# EAGLE design bluepill (EAGLE 7.4.0)
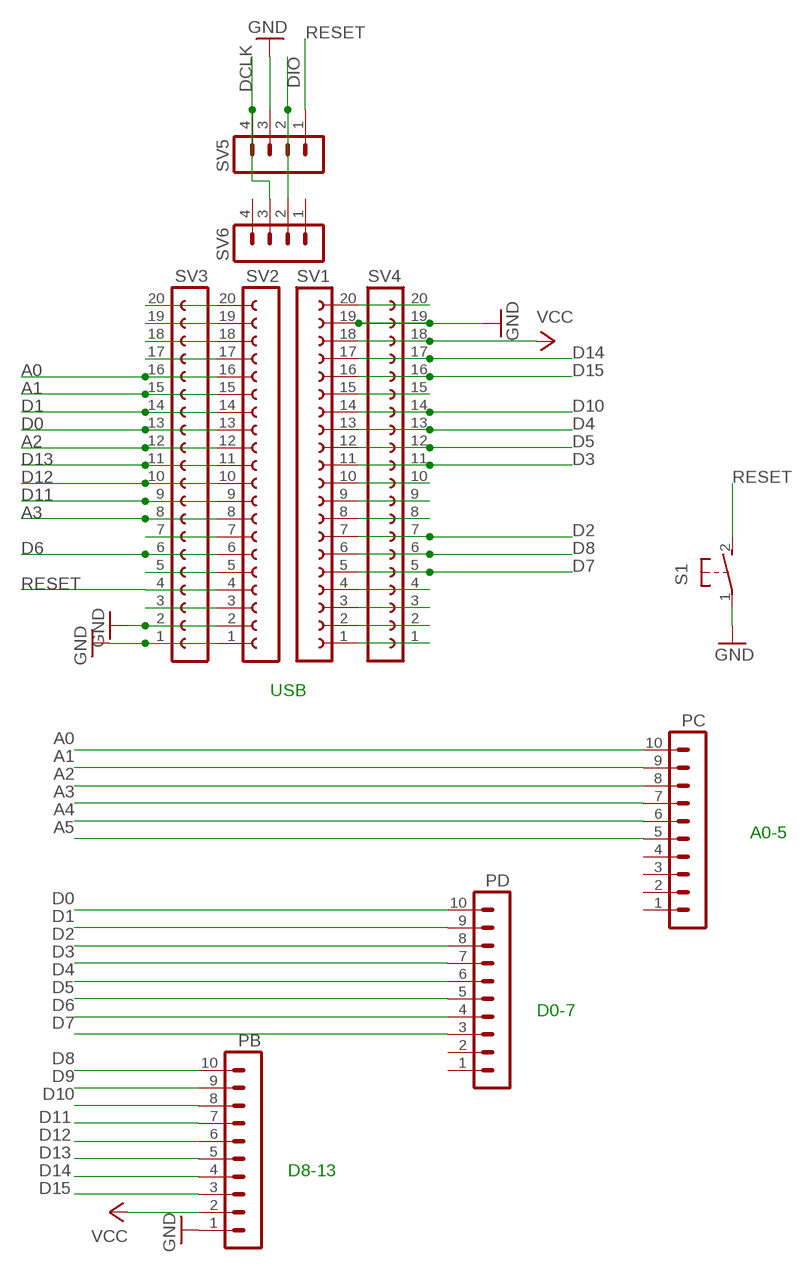
[diagram p0: schematic, sheet 1]

## Parts
PB  MA10-1W  [MA10-1W]
PC  MA10-1W  [MA10-1W]
PD  MA10-1W  [MA10-1W]
S1  31-XX  [B3F-31XX]
SV1  FE20-1  [FE20]
SV2  FE20-1  [FE20]
SV3  FE20-1  [FE20]
SV4  FE20-1  [FE20]
SV5  MA04-1  [MA04-1]
SV6  MA04-1  [MA04-1]

## Nets
A0: PC.10 SV2.16 SV3.16
A1: PC.9 SV2.15 SV3.15
A2: PC.8 SV2.12 SV3.12
A3: PC.7 SV2.8 SV3.8
A4: PC.6
A5: PC.5
D0: PD.10 SV2.13 SV3.13
D1: PD.9 SV2.14 SV3.14
D2: PD.8 SV1.7 SV4.7
D3: PD.7 SV1.11 SV4.11
D4: PD.6 SV1.13 SV4.13
D5: PD.5 SV1.12 SV4.12
D6: PD.4 SV2.6 SV3.6
D7: PD.3 SV1.5 SV4.5
D8: PB.10 SV1.6 SV4.6
D9: PB.9
D10: PB.8 SV1.14 SV4.14
D11: PB.7 SV2.9 SV3.9
D12: PB.6 SV2.10 SV3.10
D13: PB.5 SV2.11 SV3.11
D14: PB.4 SV1.17 SV4.17
D15: PB.3 SV1.16 SV4.16
DCLK: SV5.4 SV6.3
DIO: SV5.2 SV6.2
GND: PB.1 S1.1(P) SV1.19 SV2.1 SV2.2 SV3.1 SV3.2 SV4.19 SV5.3
N$1: SV2.3 SV3.3
N$3: SV2.5 SV3.5
N$4: SV2.7 SV3.7
N$5: SV2.17 SV3.17
N$6: SV2.18 SV3.18
N$7: SV2.19 SV3.19
N$8: SV2.20 SV3.20
N$10: SV1.1 SV4.1
N$11: SV1.2 SV4.2
N$12: SV1.3 SV4.3
N$13: SV1.4 SV4.4
N$14: SV1.8 SV4.8
N$15: SV1.9 SV4.9
N$16: SV1.10 SV4.10
N$17: SV1.15 SV4.15
N$18: SV1.20 SV4.20
RESET: S1.2(S) SV2.4 SV3.4 SV5.1
VCC: PB.2 SV1.18 SV4.18
Unconnected: PC.1 PC.2 PC.3 PC.4 PD.1 PD.2 SV6.1 SV6.4

## Notes on the sheet
- USB
- A0-5
- D0-7
- D8-13

## Library data of the parts
PB PC PD = con-lstb:MA10-1W: PIN HEADER
S1 = switch-omron:31-XX: OMRON SWITCH; MPN: B3F-3100; OC_FARNELL: 959704; OC_NEWARK: 36M3582
SV1-SV4 = con-lsta:FE20-1: FEMALE HEADER; OC_FARNELL: unknown; OC_NEWARK: unknown
SV5 SV6 = con-lstb:MA04-1: PIN HEADER; OC_FARNELL: unknown; OC_NEWARK: unknown

## Board
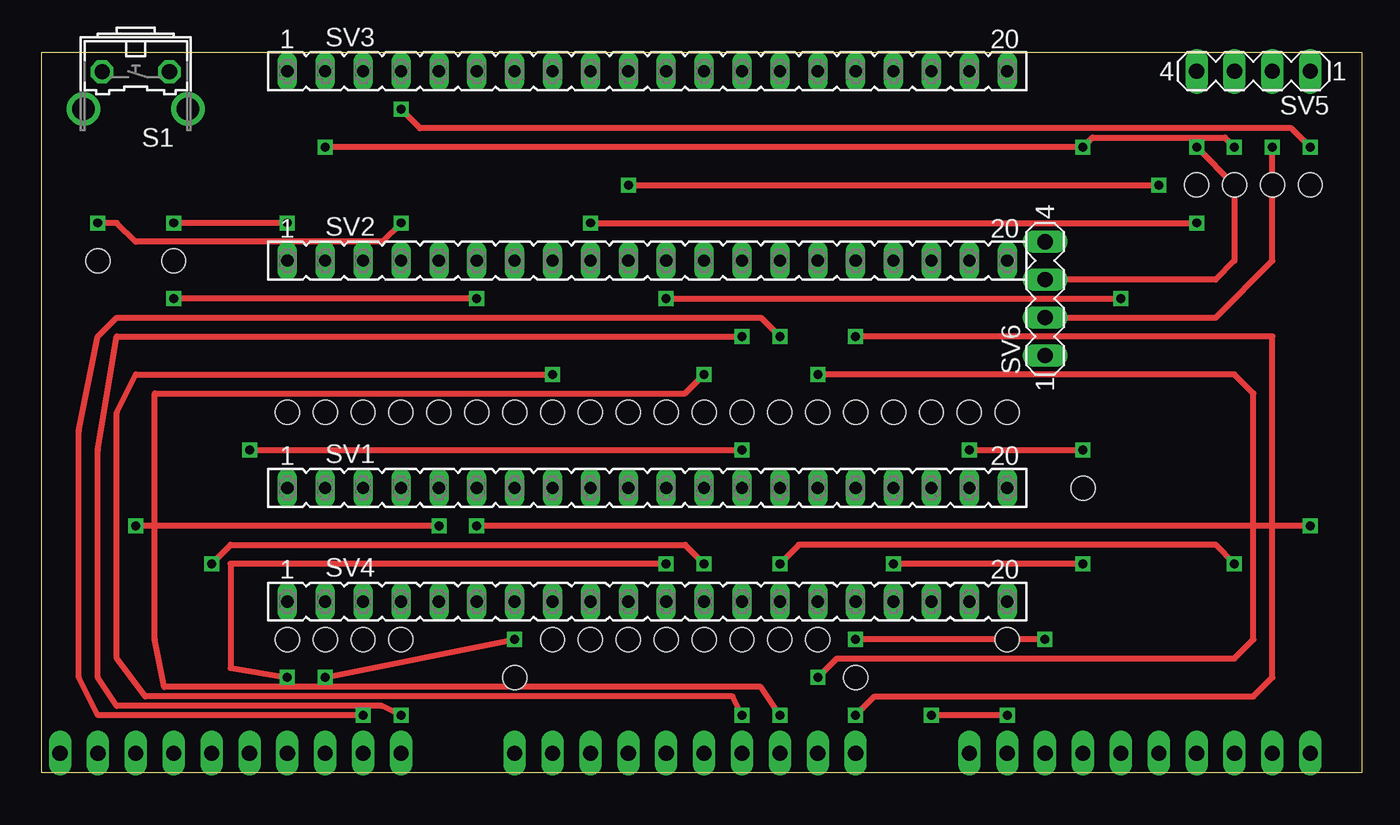
[diagram p1: board, top side]
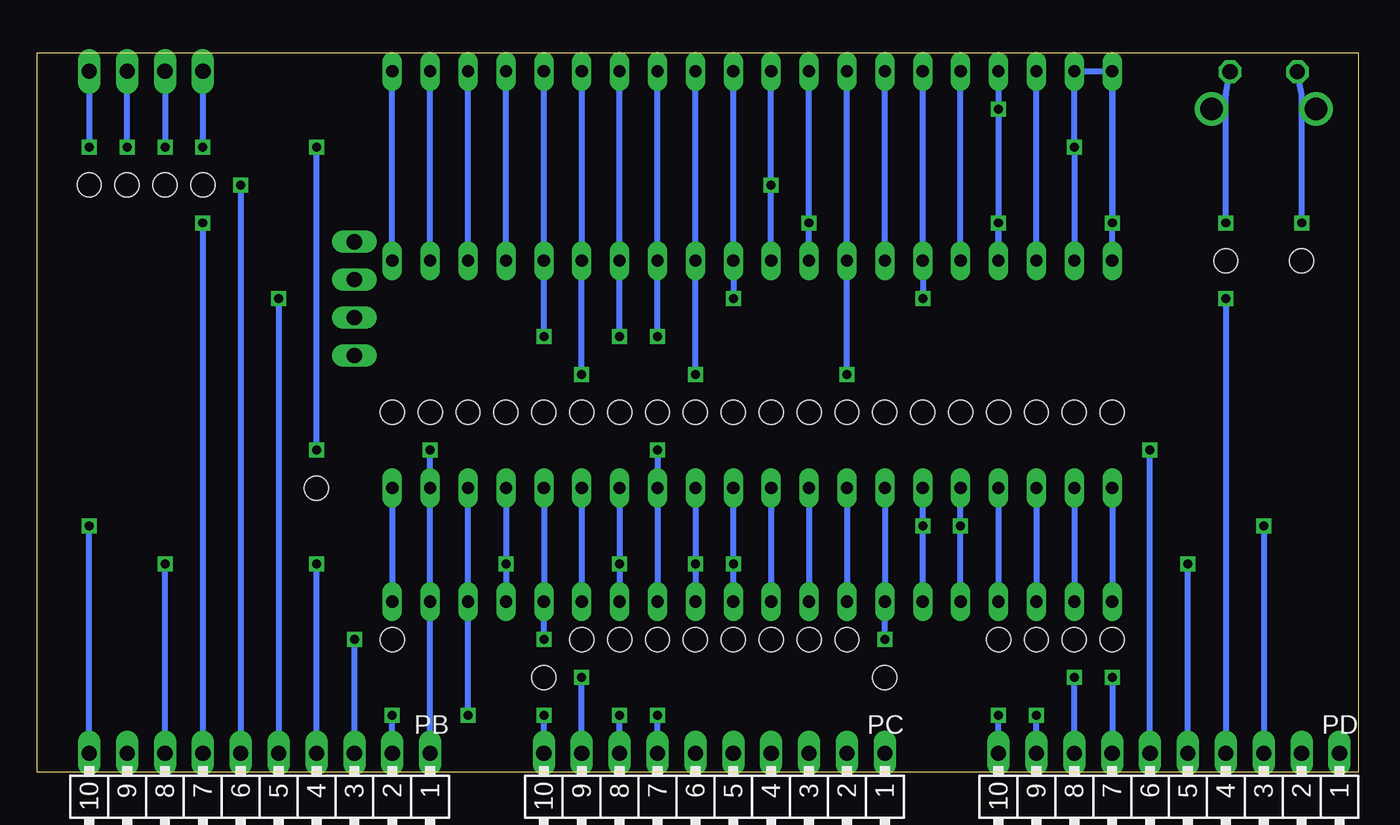
[diagram p2: board, bottom side, seen from below]

Size 88.57 x 48.25 mm. Coordinates in mm from the lower left corner, seen from the top.
Outline: 0,0 88.57,0 88.57,48.25 0,48.25 0,0
Copper layers (1*16): Top 0.035mm / dielectric 1.5mm / Bottom 0.035mm
Design rules "default": minimum track width 10mil, minimum drill 24mil, track to track 8mil, track to pad 8mil, pad to pad 8mil, via to via 8mil, smd to smd 8mil, copper to edge 40mil, drill to drill 8mil, minimum pad ring 10mil, minimum via ring 8mil, stop-mask expansion 4mil, vias tented up to drill 0mil, thermal gap 10mil
Holes 1.6 mm at 24.13,24.13 21.59,24.13 19.05,24.13 16.51,24.13 26.67,24.13 29.21,24.13 31.75,24.13 34.29,24.13 36.83,24.13 41.91,24.13 39.37,24.13 46.99,24.13 49.53,24.13 52.07,24.13 54.61,24.13 57.15,24.13 59.69,24.13 62.23,24.13 64.77,24.13 44.45,24.13 24.13,8.89 21.59,8.89 34.29,8.89 36.83,8.89 39.37,8.89 41.91,8.89 44.45,8.89 46.99,8.89 49.53,8.89 52.07,8.89 64.77,8.89 54.61,6.35 31.75,6.35 19.05,8.89 16.51,8.89 85.09,39.37 82.55,39.37 80.01,39.37 77.47,39.37 3.81,34.29 8.89,34.29 69.85,19.05

### Footprints (pad centres in the part's own frame; a part is rotated, then mirrored left to right if it is on the bottom)
MA10-1W = drill 1.016 long: 1 -11.43,0; 2 -8.89,0; 3 -6.35,0; 4 -3.81,0; 5 -1.27,0; 6 1.27,0; 7 3.81,0; 8 6.35,0; 9 8.89,0; 10 11.43,0
B3F-31XX = drill 1.016 octagon: 1 -2.261,-1.245; 2 2.261,-1.245 | drill 1.499 pad 2.159: 3 -3.505,1.245; 4 3.505,1.245
FE20 = drill 0.813 long: 1 -24.13,0; 2 -21.59,0; 3 -19.05,0; 4 -16.51,0; 5 -13.97,0; 6 -11.43,0; 7 -8.89,0; 8 -6.35,0; 9 -3.81,0; 10 -1.27,0; 11 1.27,0; 12 3.81,0; 13 6.35,0; 14 8.89,0; 15 11.43,0; 16 13.97,0; 17 16.51,0; 18 19.05,0; 19 21.59,0; 20 24.13,0
MA04-1 = drill 1.016 long: 1 -3.81,0; 2 -1.27,0; 3 1.27,0; 4 3.81,0

### Placement (x,y rotation side)
PB  73.66,1.27 180 bottom
PC  43.18,1.27 180 bottom
PD  12.7,1.27 180 bottom
S1  6.35,45.72 180 top
SV1  40.64,19.05 0 top
SV2  40.64,34.29 0 top
SV3  40.64,46.99 0 top
SV4  40.64,11.43 0 top
SV5  81.28,46.99 180 top
SV6  67.31,31.75 90 top

### Tracks (layer width: path | path; a pad name or v marks a point on that pad's centre or on a via)
A0  (via drill 0.6)
  Top 0.406: v54.61,3.81 55.88,5.08 81.28,5.08 82.55,6.35 82.55,29.21 v54.61,29.21
  Bottom 0.406: SV3.16 SV2.16 v54.61,29.21 | PC.10 v54.61,3.81
A1  (via drill 0.6)
  Top 0.406: v52.07,6.35 53.34,7.62 80.01,7.62 81.28,8.89 81.28,25.4 80.01,26.67 v52.07,26.67
  Bottom 0.406: SV3.15 SV2.15 v52.07,26.67 | PC.9 v52.07,6.35
A2  (via drill 0.6)
  Top 0.406: v49.53,3.81 48.26,5.71 8.26,5.71 7.62,8.89 7.62,25.4 43.18,25.4 v44.45,26.67
  Bottom 0.406: SV3.12 SV2.12 v44.45,26.67 | PC.8 v49.53,3.81
A3  (via drill 0.6)
  Top 0.406: v46.99,3.81 46.35,5.08 6.99,5.08 5.08,7.62 5.08,24.13 6.35,26.67 v34.29,26.67
  Bottom 0.406: SV3.8 SV2.8 v34.29,26.67 | PC.7 v46.99,3.81
D0  (via drill 0.6)
  Top 0.406: v24.13,3.81 22.86,4.45 5.08,4.45 3.81,6.35 3.81,21.59 5.08,29.21 v46.99,29.21
  Bottom 0.406: SV3.13 SV2.13 v46.99,29.21 | PD.10 v24.13,3.81
D1  (via drill 0.6)
  Top 0.406: v21.59,3.81 3.81,3.81 2.54,6.35 2.54,22.86 3.81,29.21 5.08,30.48 48.26,30.48 v49.53,29.21
  Bottom 0.406: SV3.14 SV2.14 v49.53,29.21 | PD.9 v21.59,3.81
D2  (via drill 0.6)
  Top 0.406: v19.05,6.35 v31.75,8.89
  Bottom 0.406: SV1.7 SV4.7 v31.75,8.89 | PD.8 v19.05,6.35
D3  (via drill 0.6)
  Top 0.406: v41.91,13.97 12.7,13.97 12.7,6.99 v16.51,6.35
  Bottom 0.406: SV1.11 SV4.11 v41.91,13.97 | v16.51,6.35 PD.7
D4  (via drill 0.6)
  Top 0.406: v13.97,21.59 v46.99,21.59
  Bottom 0.406: SV1.13 v46.99,21.59 SV4.13 | PD.6 v13.97,21.59
D5  (via drill 0.6)
  Top 0.406: v11.43,13.97 12.7,15.24 43.18,15.24 v44.45,13.97
  Bottom 0.406: SV1.12 v44.45,13.97 SV4.12 | PD.5 v11.43,13.97
D6  (via drill 0.6)
  Top 0.406: v29.21,31.75 v8.89,31.75
  Bottom 0.406: SV3.6 SV2.6 v29.21,31.75 | v8.89,31.75 PD.4
D7  (via drill 0.6)
  Top 0.406: v26.67,16.51 v6.35,16.51
  Bottom 0.406: SV4.5 v26.67,16.51 SV1.5 | v6.35,16.51 PD.3
D8  (via drill 0.6)
  Top 0.406: v85.09,16.51 v29.21,16.51
  Bottom 0.406: SV4.6 v29.21,16.51 SV1.6 | PB.10 v85.09,16.51
D10  (via drill 0.6)
  Top 0.406: v80.01,13.97 78.74,15.24 50.8,15.24 v49.53,13.97
  Bottom 0.406: SV1.14 v49.53,13.97 SV4.14 | PB.8 v80.01,13.97
D11  (via drill 0.6)
  Top 0.406: v36.83,36.83 v77.47,36.83
  Bottom 0.406: SV3.9 SV2.9 v36.83,36.83 | v77.47,36.83 PB.7
D12  (via drill 0.6)
  Top 0.406: v39.37,39.37 v74.93,39.37
  Bottom 0.406: SV3.10 SV2.10 v39.37,39.37 | v74.93,39.37 PB.6
D13  (via drill 0.6)
  Top 0.406: v41.91,31.75 v72.39,31.75
  Bottom 0.406: SV3.11 SV2.11 v41.91,31.75 | v72.39,31.75 PB.5
D14  (via drill 0.6)
  Top 0.406: v69.85,13.97 v57.15,13.97
  Bottom 0.406: SV1.17 SV4.17 v57.15,13.97 | PB.4 v69.85,13.97
D15  (via drill 0.6)
  Top 0.406: v67.31,8.89 v54.61,8.89
  Bottom 0.406: SV1.16 SV4.16 v54.61,8.89 | PB.3 v67.31,8.89
DCLK  (via drill 0.6)
  Top 0.406: v77.47,41.91 80.01,39.37 80.01,34.29 78.74,33.02 SV6.3
  Bottom 0.406: SV5.4 v77.47,41.91
DIO  (via drill 0.6)
  Top 0.406: SV6.2 78.74,30.48 82.55,34.29 v82.55,41.91
  Bottom 0.406: v82.55,41.91 SV5.2
GND  (via drill 0.6)
  Top 0.406: v16.51,36.83 v8.89,36.83 | v19.05,41.91 v69.85,41.91 70.48,42.54 79.38,42.54 v80.01,41.91 | v62.23,21.59 v69.85,21.59
  Bottom 0.406: SV2.1 SV3.1 | SV3.1 SV3.2 v19.05,41.91 SV2.2 | PB.1 SV4.19 SV1.19 v62.23,21.59 | SV3.1 v16.51,36.83 | v8.89,36.83 8.89,45.41 S1.1 | v69.85,21.59 v69.85,41.91 | SV5.3 v80.01,41.91
N$1
  Bottom 0.406: SV2.3 SV3.3
N$3
  Bottom 0.406: SV2.5 SV3.5
N$4
  Bottom 0.406: SV2.7 SV3.7
N$5
  Bottom 0.406: SV2.17 SV3.17
N$6
  Bottom 0.406: SV2.18 SV3.18
N$7
  Bottom 0.406: SV2.19 SV3.19
N$8
  Bottom 0.406: SV2.20 SV3.20
N$10
  Bottom 0.406: SV1.1 SV4.1
N$11
  Bottom 0.406: SV1.2 SV4.2
N$12
  Bottom 0.406: SV1.3 SV4.3
N$13
  Bottom 0.406: SV1.4 SV4.4
N$14
  Bottom 0.406: SV1.8 SV4.8
N$15
  Bottom 0.406: SV1.9 SV4.9
N$16
  Bottom 0.406: SV1.10 SV4.10
N$17
  Bottom 0.406: SV1.15 SV4.15
N$18
  Bottom 0.406: SV1.20 SV4.20
RESET  (via drill 0.6)
  Top 0.406: v24.13,36.83 22.86,35.56 6.35,35.56 5.08,36.83 v3.81,36.83 | v85.09,41.91 83.82,43.18 25.4,43.18 v24.13,44.45
  Bottom 0.406: SV3.4 v24.13,44.45 SV2.4 v24.13,36.83 | v3.81,36.83 3.81,45.41 S1.2 | SV5.1 v85.09,41.91
VCC  (via drill 0.6)
  Top 0.406: v64.77,3.81 v59.69,3.81
  Bottom 0.406: SV1.18 SV4.18 v59.69,3.81 | PB.2 v64.77,3.81

### Text on the board
Top: D0-7 | A0-A5 | D8-13
tDocu: SWD | RESET | USB